# Altium schematic sheet StepStick_Driver.SchDoc: Motor_Driver
size A4; ApprovedBy: Eli; CheckedBy: Eli; DrawnBy: Eli; Engineer: Eli; Organization: 富源盛电子科技有限公司; Address1: 深圳市龙华新区; Address2: 观澜街道科利邦工业园; Address3: B栋（宿舍楼）15楼; Address4: T: 159 8944 7740; DocumentNumber: 5; Revision: 1.0; SheetNumber: 5; SheetTotal: 8; Status: Final
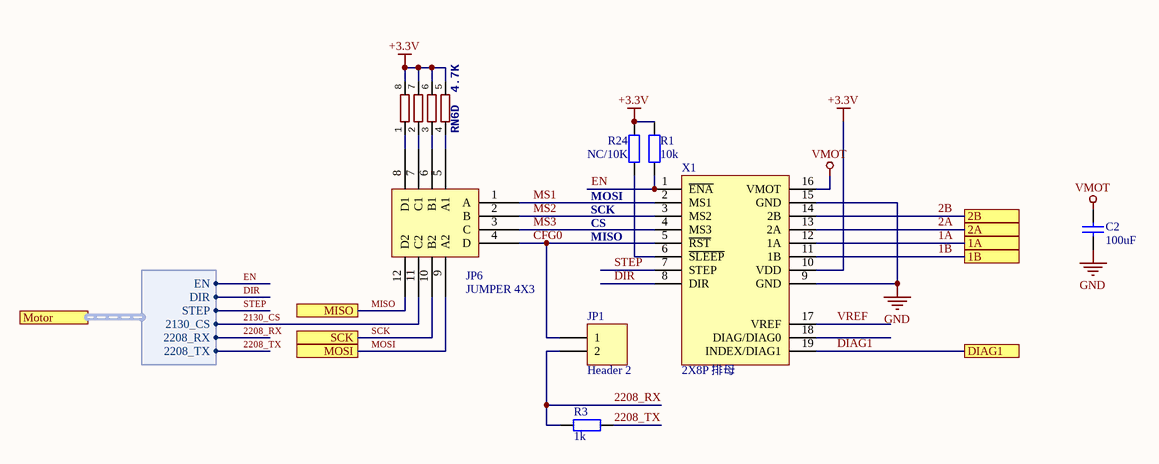
[diagram p0: StepStick_Driver.SchDoc]

## Parts
C2  100uF  [ELCO Case D]
JP1  Header 2  [HDR1X2]
JP6  JUMPER 4X3  [HEADER 3x4]
R1  10k  [RES0603]
R3  1k  [RES0402]
R24  NC/10K  [RES0603]
RN6  4.7K  [RESISTOR-DIL_CAY16]  (value not drawn)  (parts A,B,C,D of 4)
X1  2X8P 排母  [TMC_breakout]

## Ports
1A, 1B, 2A, 2B, DIAG1, MISO, MOSI, Motor (harness Motor), SCK

## Harnesses
Motor: EN, DIR, STEP, 2130_CS, 2208_RX, 2208_TX

## Nets
+3.3V: R1.2 R24.2 RN6.5 RN6.6 RN6.7 RN6.8 X1.10(VDD)
GND: C2.2 X1.9(GND) X1.15(GND)
VMOT: C2.1 X1.16(VMOT)
1A: X1.12(1A) ; port 1A
1B: X1.11(1B) ; port 1B
2A: X1.13(2A) ; port 2A
2B: X1.14(2B) ; port 2B
2130_CS: JP6.11(C2) ; port Motor.2130_CS
2208_RX: JP1.2 R3.1 ; port Motor.2208_RX
2208_TX: R3.2 ; port Motor.2208_TX
CFG0: JP1.1 JP6.4(D) X1.5(~{RST})
DIAG1: X1.19(INDEX/DIAG1) ; port DIAG1
DIR: X1.8(DIR) ; port Motor.DIR
EN: R1.1 X1.1(~{ENA}) ; port Motor.EN
MISO: JP6.12(D2) ; port MISO
MOSI: JP6.9(A2) ; port MOSI
MS1: JP6.1(A) X1.2(MS1)
MS2: JP6.2(B) X1.3(MS2)
MS3: JP6.3(C) X1.4(MS3)
SCK: JP6.10(B2) ; port SCK
STEP: X1.7(STEP) ; port Motor.STEP
VREF: X1.17(VREF)
NetJP6_5: JP6.5(A1) RN6.4
NetJP6_6: JP6.6(B1) RN6.3
NetJP6_7: JP6.7(C1) RN6.2
NetJP6_8: JP6.8(D1) RN6.1
NetR24_1: R24.1 X1.6(~{SLEEP})

Not connected (* = marked no-connect by the designer): X1 18(DIAG/DIAG0)

## Notes on the sheet
- MOSI
- CS
- SCK
- MISO
- Title
- Size:
- Date:
- A4
- Number:
- Time:
- Revision:
- Sheet
- of
- File:

## Library data of the parts
C2 = Capacitor
JP1 = Header 2: Header, 2-Pin; LatestRevisionDate: 17-Jul-2002; LatestRevisionNote: Re-released for DXP Platform.; Publisher: Altium Limited
R1 R3 = Resistor_2: RO RES 1k0 1% 0,1W  0603; ID: Library_RES-0004; Faber ItemCode: 34637900; Info: Resistor
  R1: Value: 10k
  R3: Value: 1k
R24 = Resistor_2: RO RES 1k0 1% 0,1W  0603; ID: Library_RES-0004; Faber ItemCode: 34637900; Value: 10k; Info: Resistor
RN6 = RESISTOR-DIL_4R-NCAY16: OC_FARNELL: unknown; OC_NEWARK: unknown
X1 = TMC_BREAKOUT